# Altium schematic sheet DXP格式 压力计 报警.SchDoc
size A4
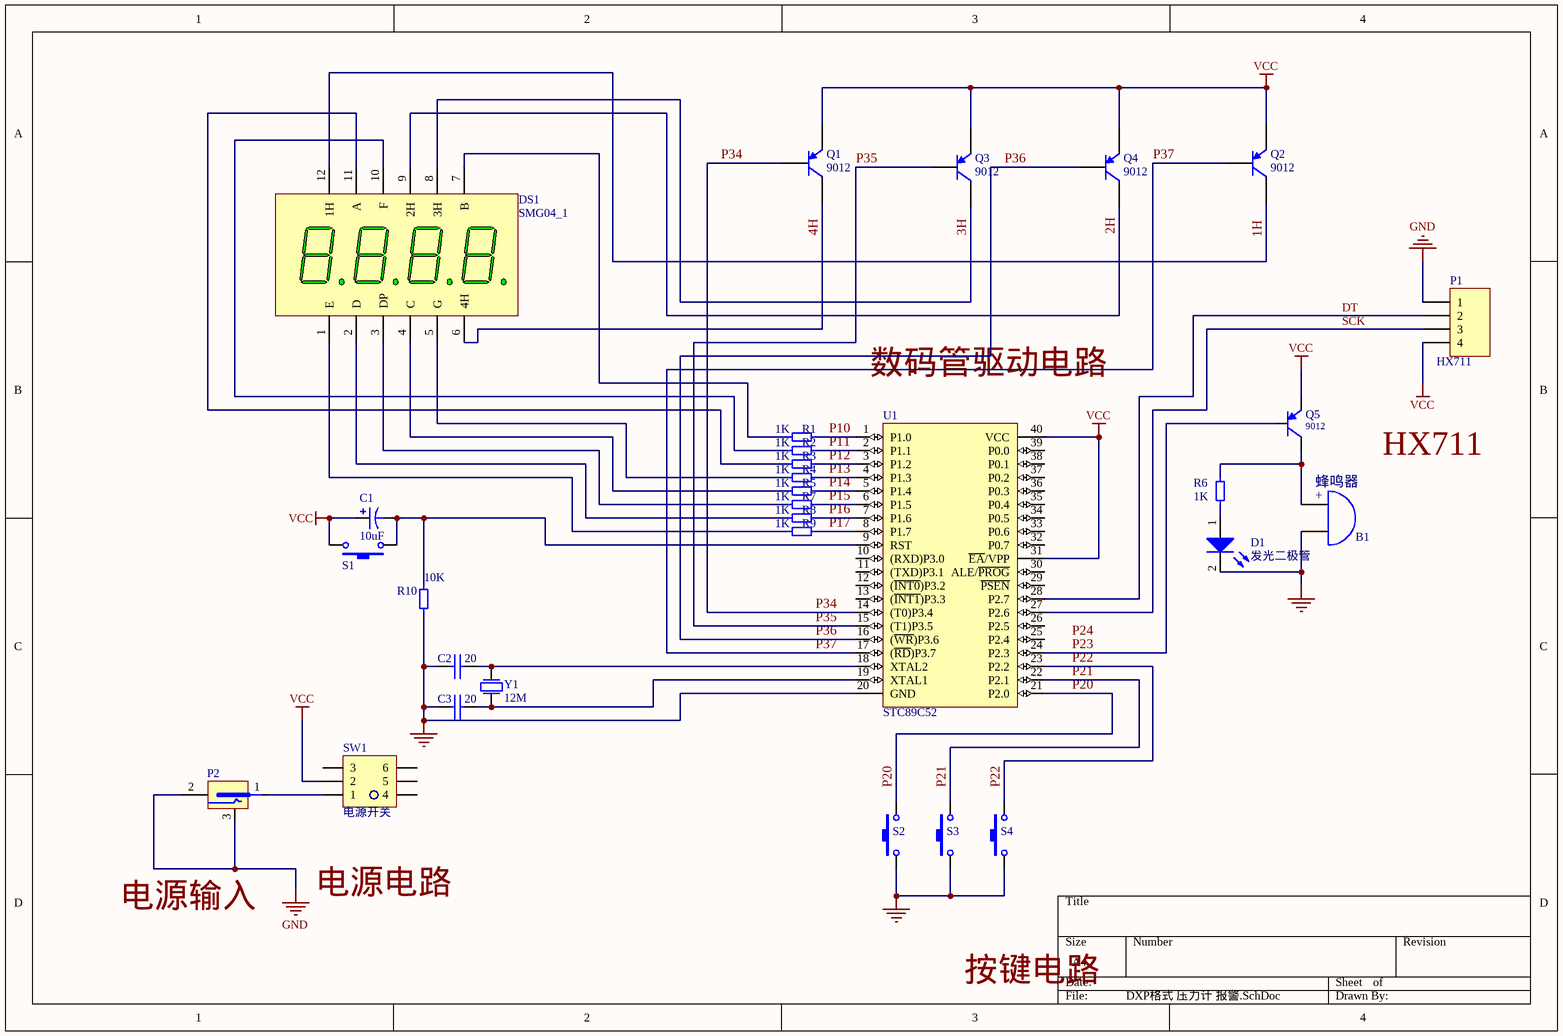
[diagram p0: DXP格式 压力计 报警.SchDoc]

## Parts
B1  蜂鸣器  [Bett]
C1  10uF  [C_10]
C2  20  [CAP CP]
C3  20  [CAP CP]
D1  发光二极管  [LED直插]
DS1  SMG04_1  [SMG04]
P1  HX711  [HX711]
P2  电源输入  [DC2.1]  (value not drawn)
Q1  9012  [s三极管直插]
Q2  9012  [s三极管直插]
Q3  9012  [s三极管直插]
Q4  9012  [s三极管直插]
Q5  9012  [s三极管直插]
R1  1K  [AXIAL0.3]
R2  1K  [AXIAL0.3]
R3  1K  [AXIAL0.3]
R4  1K  [AXIAL0.3]
R5  1K  [AXIAL0.3]
R6  1K  [AXIAL0.3]
R7  1K  [AXIAL0.3]
R8  1K  [AXIAL0.3]
R9  1K  [AXIAL0.3]
R10  10K  [AXIAL0.3]
S1  SW-PB  [key]  (value not drawn)
S2  SW-PB  [key]  (value not drawn)
S3  SW-PB  [key]  (value not drawn)
S4  SW-PB  [key]  (value not drawn)
SW1  电源开关  [sw_自锁 1]
U1  STC89C52  [DIP40 - 做板]
Y1  12M  [XTAL]

## Nets
GND: B1.2(B) C2.1 C3.1 D1.2 P1.1 P2.2 P2.3 R10.1 S2.1 S3.1 S4.1 U1.20(GND)
VCC: C1.1 P1.4 Q1.1(E) Q2.1(E) Q3.1(E) Q4.1(E) Q5.1(E) S1.2 SW1.2 U1.31(~{EA}/VPP) U1.40(VCC)
1H: DS1.12(1H) Q2.3(C)
2H: DS1.9(2H) Q4.3(C)
3H: DS1.8(3H) Q3.3(C)
4H: DS1.6(4H) Q1.3(C)
DT: P1.2 U1.28(P2.7)
P10: R1.2 U1.1(P1.0)
P11: R2.2 U1.2(P1.1)
P12: R3.2 U1.3(P1.2)
P13: R4.2 U1.4(P1.3)
P14: R5.2 U1.5(P1.4)
P15: R7.2 U1.6(P1.5)
P16: R8.2 U1.7(P1.6)
P17: R9.2 U1.8(P1.7)
P20: S2.2 U1.21(P2.0)
P21: S3.2 U1.22(P2.1)
P22: S4.2 U1.23(P2.2)
P23: Q5.2(B) U1.24(P2.3)
P34: Q1.2(B) U1.14((T0)P3.4)
P35: Q3.2(B) U1.15((T1)P3.5)
P36: Q4.2(B) U1.16((~{WR})P3.6)
P37: Q2.2(B) U1.17((~{RD})P3.7)
SCK: P1.3 U1.27(P2.6)
NetB1_1: B1.1(A) Q5.3(C) R6.1
NetC1_2: C1.2 R10.2 S1.1 U1.9(RST)
NetC2_2: C2.2 U1.18(XTAL2) Y1.1(P1)
NetC3_2: C3.2 U1.19(XTAL1) Y1.2(P2)
NetD1_1: D1.1 R6.2
NetDS1_1: DS1.1(E) R9.1
NetDS1_2: DS1.2(D) R8.1
NetDS1_3: DS1.3(DP) R7.1
NetDS1_4: DS1.4(C) R5.1
NetDS1_5: DS1.5(G) R4.1
NetDS1_7: DS1.7(B) R1.1
NetDS1_10: DS1.10(F) R2.1
NetDS1_11: DS1.11(A) R3.1
NetP2_1: P2.1 SW1.1

Not connected (* = marked no-connect by the designer): SW1 3 4 5 6; U1 10((RXD)P3.0) 11((TXD)P3.1) 12((~{INT0})P3.2) 13((~{INT1})P3.3) 25(P2.4) 26(P2.5) 29(~{PSEN}) 30(ALE/~{PROG}) 32(P0.7) 33(P0.6) 34(P0.5) 35(P0.4) 36(P0.3) 37(P0.2) 38(P0.1) 39(P0.0)

## Notes on the sheet
- (near B1) +
- Labels drawn without touching a wire or pin: HX711, P24, 按键电路, 数码管驱动电路, 电源电路, 电源输入

## Library data of the parts
B1 = BELL
C1 = Cap Pol1: Polarized Capacitor (Radial); Published: 8-Jun-2000; LatestRevisionDate: 17-Jul-2002; LatestRevisionNote: Re-released for DXP Platform.; PackageReference: RB7.6-15; Publisher: Altium Limited
C2 C3 = CAP: 电容
D1 = D
P1 = Header 4: Header, 4-Pin; LatestRevisionDate: 17-Jul-2002; LatestRevisionNote: Re-released for DXP Platform.; Publisher: Altium Limited
P2 = POWER
Q1-Q5 = 2N3906: PNP General Purpose Amplifier; Published: 8-Jun-2000; LatestRevisionDate: 15-Jan-2003; LatestRevisionNote: PCB Footprint 'BCY-W3/D4.7' replaced; PackageReference: TO-92A; Publisher: Altium Limited; Code_JEDEC: TO-92A; ComponentLink1Description: Manufacturer Link; ComponentLink1URL: http://www.fairchildsemi.com/; ComponentLink2Description: Datasheet; ComponentLink2URL: http://www.fairchildsemi.com/ds/2N%2F2N3906.pdf
  Q1-Q4: DatasheetVersion: 1997; PackageVersion: Sep-1998
  Q5: DatasheetDocument: 1997; PackageDocument: Sep-1998
R1-R10 = RES2
S1-S4 = SW-PB: Switch; Published: 24-Mar-1999; LatestRevisionDate: 17-Jul-2002; LatestRevisionNote: Re-released for DXP Platform.; PackageReference: SPST-2; Publisher: Altium Limited
SW1 = SW1
U1 = U1
Y1 = 16M: Crystal Oscillator